# Altium schematic sheet Lin-reg.SchDoc
size A4
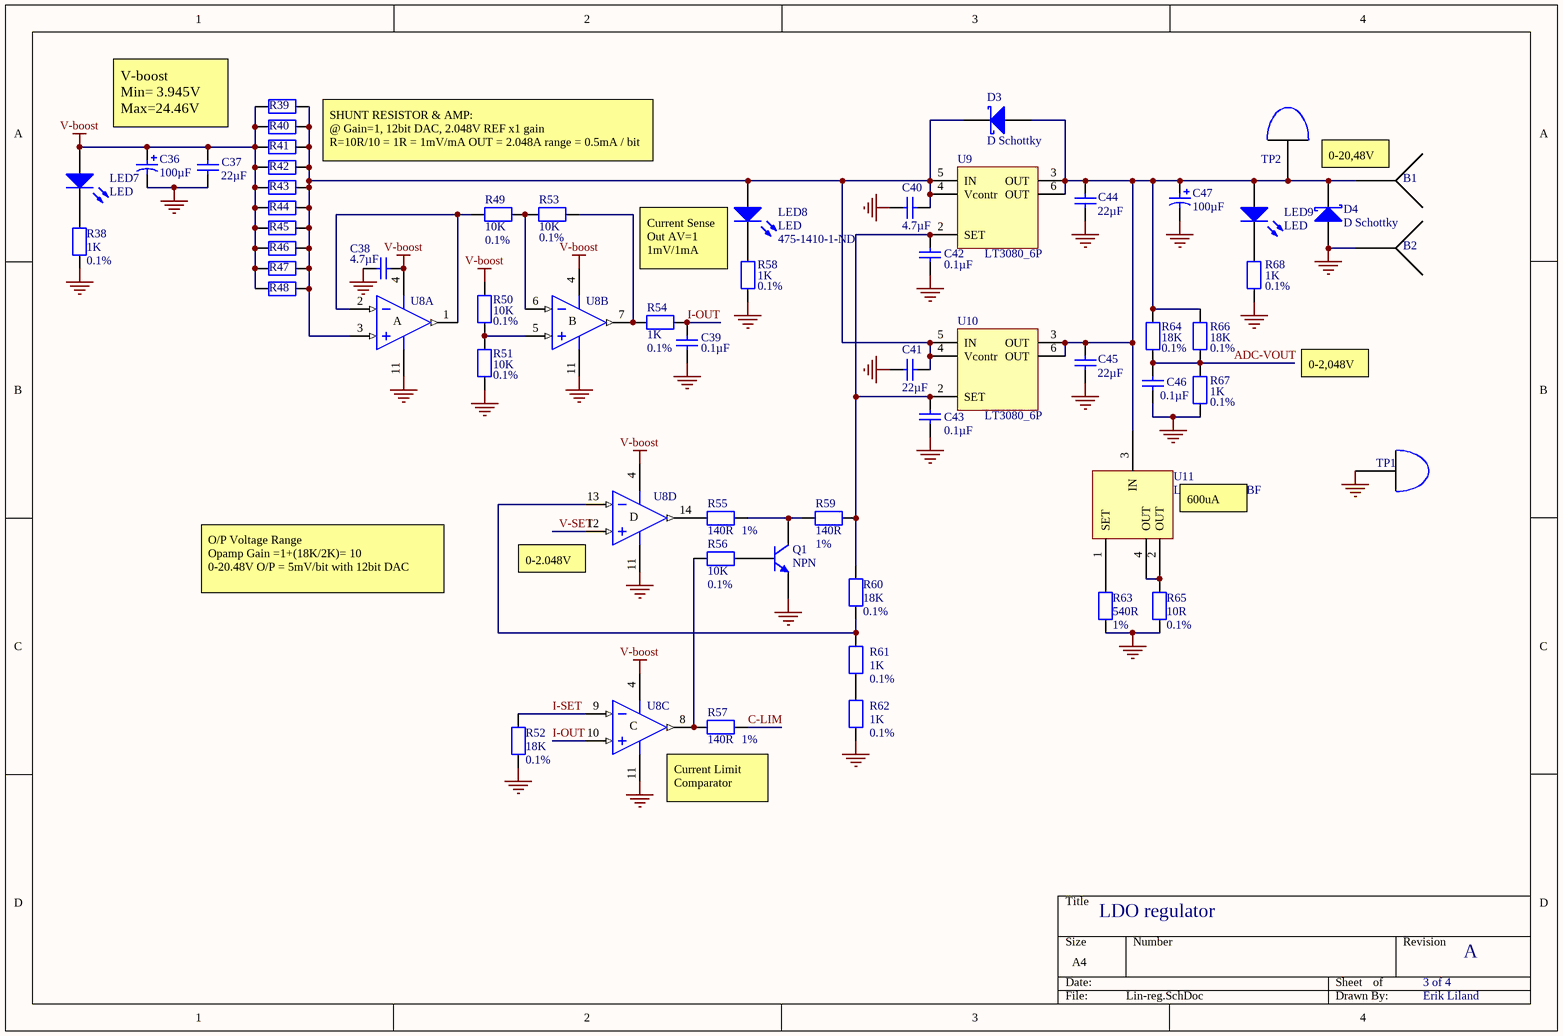
[diagram p0: Lin-reg.SchDoc]

## Parts
B1  Banana socket pcb  [PCB Banana jack red]  (value not drawn)
B2  Banana socket pcb  [PCB Banana jack black]  (value not drawn)
C36  100µF  [CAP SMD (F)]
C37  22µF  [0805_N_CAP]
C38  4.7µF  [0805_N_CAP]
C39  0.1µF  [0805_N_CAP]
C40  4.7µF  [0805_N_CAP]
C41  22µF  [0805_N_CAP]
C42  0.1µF  [0805_N_CAP]
C43  0.1µF  [0805_N_CAP]
C44  22µF  [0805_N_CAP]
C45  22µF  [0805_N_CAP]
C46  0.1µF  [0805_N_CAP]
C47  100µF  [CAP SMD (F)]
D3  D Schottky  [DO-214AC, SMA]
D4  D Schottky  [DO-214AC, SMA]
LED7  LED  [0805_N_LED]
LED8  LED  Supplier Part Number 1: 475-1410-1-ND  [0805_N_LED]
LED9  LED  [0805_N_LED]
Q1  NPN  [SOT-23_N]
R38  1K  Tolerance: 0.1%  [0805_N_RES]
R39  10R  [0805_N_RES]  (value not drawn)
R40  10R  [0805_N_RES]  (value not drawn)
R41  10R  [0805_N_RES]  (value not drawn)
R42  10R  [0805_N_RES]  (value not drawn)
R43  10R  [0805_N_RES]  (value not drawn)
R44  10R  [0805_N_RES]  (value not drawn)
R45  10R  [0805_N_RES]  (value not drawn)
R46  10R  [0805_N_RES]  (value not drawn)
R47  10R  [0805_N_RES]  (value not drawn)
R48  10R  [0805_N_RES]  (value not drawn)
R49  10K  Tolerance: 0.1%  [0805_N_RES]
R50  10K  Tolerance: 0.1%  [0805_N_RES]
R51  10K  Tolerance: 0.1%  [0805_N_RES]
R52  18K  Tolerance: 0.1%  [0805_N_RES]
R53  10K  Tolerance: 0.1%  [0805_N_RES]
R54  1K  Tolerance: 0.1%  [0805_N_RES]
R55  140R  Tolerance: 1%  [0805_N_RES]
R56  10K  Tolerance: 0.1%  [0805_N_RES]
R57  140R  Tolerance: 1%  [0805_N_RES]
R58  1K  Tolerance: 0.1%  [0805_N_RES]
R59  140R  Tolerance: 1%  [0805_N_RES]
R60  18K  Tolerance: 0.1%  [0805_N_RES]
R61  1K  Tolerance: 0.1%  [0805_N_RES]
R62  1K  Tolerance: 0.1%  [0805_N_RES]
R63  540R  Tolerance: 1%  [0805_N_RES]
R64  18K  Tolerance: 0.1%  [0805_N_RES]
R65  10R  Tolerance: 0.1%  [0805_N_RES]
R66  18K  Tolerance: 0.1%  [0805_N_RES]
R67  1K  Tolerance: 0.1%  [0805_N_RES]
R68  1K  Tolerance: 0.1%  [0805_N_RES]
TP1  Test-point  [Test point]  (value not drawn)
TP2  Test-point  [Test point]  (value not drawn)
U8  BA2902FV  [TSSOP14_N]  (value not drawn)  (parts A,B,C,D of 4)
U9  LT3080_6P  [DD-PAK-5_N_HEATSINK]
U10  LT3080_6P  [DD-PAK-5_N_HEATSINK]
U11  LT3092EST#PBF  [SOT223_N]

## Nets
GND: B2.1 C36.2 C37.2 C38.1 C39.1 C40.2 C41.2 C42.1 C43.1 C44.2 C45.2 C46.1 C47.2 D4.1(A) Q1.2(E) R38.1 R51.1 R52.1 R58.2 R62.2 R63.1 R65.2 R67.2 R68.2 TP1.1(TP) U8.11(VEE)
V-boost: C36.1 C37.1 C38.2 LED7.1(A) R39.2 R40.2 R41.2 R42.2 R43.2 R44.2 R45.2 R46.2 R47.2 R48.2 R50.2 U8.4(VCC)
ADC-VOUT: C46.2 R64.2 R66.2 R67.1
C-LIM: R57.2
I-OUT: C39.2 R54.1 U8.10(+IN3)
I-SET: R52.2 U8.9(-IN3)
V-SET: U8.12(+IN4)
NetB1_1: B1.1 C44.1 C45.1 C47.1 D3.1(A) D4.2(K) LED9.1(A) R64.1 R66.1 TP2.1(TP) U9.3(OUT) U9.6(OUT) U10.3(OUT) U10.6(OUT) U11.3(IN)
NetC40_1: C40.1 C41.1 D3.2(K) LED8.1(A) R39.1 R40.1 R41.1 R42.1 R43.1 R44.1 R45.1 R46.1 R47.1 R48.1 U8.3(+IN1) U9.4(Vcontr) U9.5(IN) U10.4(Vcontr) U10.5(IN)
NetC42_2: C42.2 C43.2 R59.2 R60.1 U9.2(SET) U10.2(SET)
NetLED7_2: LED7.2(K) R38.2
NetLED8_2: LED8.2(K) R58.1
NetLED9_2: LED9.2(K) R68.1
NetQ1_1: Q1.1(B) R56.1
NetQ1_3: Q1.3(C) R55.2 R59.1
NetR49_1: R49.1 U8.1(OUT1) U8.2(-IN1)
NetR49_2: R49.2 R53.1 U8.6(-IN2)
NetR50_1: R50.1 R51.2 U8.5(+IN2)
NetR53_2: R53.2 R54.2 U8.7(OUT2)
NetR55_1: R55.1 U8.14(OUT4)
NetR56_2: R56.2 R57.1 U8.8(OUT3)
NetR60_2: R60.2 R61.1 U8.13(-IN4)
NetR61_2: R61.2 R62.1
NetR63_2: R63.2 U11.1(SET)
NetR65_1: R65.1 U11.2(OUT) U11.4(OUT)

## Notes on the sheet
- V-boost
  Min= 3.945V
  Max=24.46V
- SHUNT RESISTOR & AMP:
  @ Gain=1, 12bit DAC, 2.048V REF x1 gain
  R=10R/10 = 1R = 1mV/mA OUT = 2.048A range = 0.5mA / bit
- (near B1) 0-20,48V
- Current Sense Out AV=1
  1mV/1mA
- 0-2,048V
- (near U11) 600uA
- (near U8) 0-2.048V
- O/P Voltage Range
  Opamp Gain =1+(18K/2K)= 10
  0-20.48V O/P = 5mV/bit with 12bit DAC
- (near U8) Current Limit Comparator
- LDO regulator
- 3 of 4
- A
- Erik Liland
- (in symbol BA2902FV, part A) A
- (in symbol BA2902FV, part B) B
- (in symbol BA2902FV, part C) C
- (in symbol BA2902FV, part D) D

## Library data of the parts
B1 B2 = Banana socket pcb: 2.54mm skrew terminal; Supplier 1: Farnell
  B1: Supplier Part Number 1: 1854508
  B2: Supplier Part Number 1: 1854507
C36 C47 = Cap Pol: Polarized Capacitor; Manufacturer: Panasonic Electronic Components; Manufacturer Part Number: EEH-ZA1H101P; Tolerance: ±20%; ESR (Equivalent Series Resistance): 28 mOhm; Lifetime @ Temp.: 10000 Hrs @ 105°C; Type: Polymer - Hybrid; Ripple Current: 2A; Surface Mount Land Size: 0.406" L x 0.406" W (10.30mm x 10.30mm); Voltage - Rated: 50V; Supplier 1: Digi-Key; Supplier Part Number 1: P15442CT-ND; RoHS: RoHS Compliant; Category: Capacitors; Stock 1: 4202; Pricing 1: 1=2.9, 10=2.406, 25=2.2996, 50=2.229, 100=2.1227, 250=1.98124 (EUR); Packaging: Cut Tape (CT); Capacitance: 100µF; Operating Temperature: -55°C ~ 105°C; Size / Dimension: 0.394" Dia (10.00mm); Height - Seated (Max): 0.413" (10.50mm); Mounting Type: Surface Mount; Package / Case: Radial, Can - SMD; ComponentLink1URL: http://industrial.panasonic.com/www-data/pdf/ABA0000/ABA0000CE136.pdf; ComponentLink1Description: http://industrial.panasonic.com/www-data/pdf/ABA0000/ABA0000CE136.pdf
C37 C41 C44 C45 = Cap: Capacitor; Manufacturer: TDK Corporation; Manufacturer Part Number: C2012X5R1V226M125AC; Tolerance: ±20%; Voltage - Rated: 35V; Temperature Coefficient: X5R; Supplier 1: Digi-Key; Supplier Part Number 1: 445-14428-1-ND; RoHS: RoHS Compliant; Category: Capacitors; Stock 1: 68492; Pricing 1: 1=1.19, 10=0.996, 100=0.6357, 250=0.52976, 500=0.47676, 1000=0.42586 (EUR); Packaging: Cut Tape (CT); Capacitance: 22µF; Mounting Type: Surface Mount, MLCC; Operating Temperature: -55°C ~ 85°C; Package / Case: 0805 (2012 Metric); Size / Dimension: 0.079" L x 0.049" W (2.00mm x 1.25mm); Height - Seated (Max): -; Thickness (Max): 0.057" (1.45mm); ComponentLink1URL: http://product.tdk.com/en/catalog/datasheets/mlcc_commercial_general_en.pdf; ComponentLink1Description: http://product.tdk.com/en/catalog/datasheets/mlcc_commercial_general_en.pdf
C38 C40 = Cap: Capacitor; Manufacturer: Samsung Electro-Mechanics America, Inc; Manufacturer Part Number: CL21B475KOFNFNE; Tolerance: ±10%; Voltage - Rated: 16V; Temperature Coefficient: X7R; Supplier 1: Digi-Key; Supplier Part Number 1: 1276-2970-1-ND; RoHS: RoHS Compliant; Category: Capacitors; Stock 1: 58798; Pricing 1: 1=0.27, 10=0.18, 25=0.1308, 100=0.0915, 500=0.06538, 1000=0.05557 (EUR); Packaging: Cut Tape (CT); Capacitance: 4.7µF; Mounting Type: Surface Mount, MLCC; Operating Temperature: -55°C ~ 125°C; Package / Case: 0805 (2012 Metric); Size / Dimension: 0.079" L x 0.049" W (2.00mm x 1.25mm); Height - Seated (Max): -; Thickness (Max): 0.053" (1.35mm); ComponentLink1URL: http://www.samsungsem.com/kr/front/downloadcms.do?path=/kr/support/product-search/mlcc/__icsFiles/afieldfile/2014/11/05&fileName=S_CL21B475KOFNFNE.pdf; ComponentLink1Description: http://www.samsungsem.com/kr/front/downloadcms.do?path=/kr/support/product-search/mlcc/__icsFiles/afieldfile/2014/11/05&fileName=S_CL21B475KOFNFNE.pdf
C39 C42 C43 C46 = Cap: Capacitor; Manufacturer: Kemet; Manufacturer Part Number: C0805C104K4RACTU; Temperature Coefficient: X7R; Tolerance: ±10%; Voltage - Rated: 16V; Capacitance: 0.1µF; Category: Capacitors; ComponentLink1Description: http://www.kemet.com/docfinder?Partnumber=C0805C104K4RACTU; ComponentLink1URL: http://www.kemet.com/docfinder?Partnumber=C0805C104K4RACTU; Height - Seated (Max): -; Mounting Type: Surface Mount, MLCC; Operating Temperature: -55°C ~ 125°C; Package / Case: 0805 (2012 Metric); Packaging: Cut Tape (CT); Pricing 1: 1=0.11, 10=0.076, 50=0.0436, 100=0.0359, 250=0.03024, 500=0.02534, 1000=0.02081 (EUR); RoHS: RoHS Compliant; Size / Dimension: 0.079" L x 0.049" W (2.00mm x 1.25mm); Stock 1: 286232; Supplier 1: Digi-Key; Supplier Part Number 1: 399-1167-1-ND; Thickness (Max): 0.035" (0.88mm)
D3 D4 = D Schottky: Schottky Diode; Manufacturer: Micro Commercial Co; Manufacturer Part Number: SK33A-TP; Voltage - DC Reverse (Vr) (Max): 30V; Current - Average Rectified (Io): 3A; Voltage - Forward (Vf) (Max) @ If: 500mV @ 3A; Speed: Fast Recovery =< 500ns, > 200mA (Io); Current - Reverse Leakage @ Vr: 500µA @ 30V; Capacitance @ Vr, F: 250pF @ 4V, 1MHz; Supplier 1: Digi-Key; Supplier Part Number 1: SK33A-TPCT-ND; RoHS: RoHS Compliant; Category: Discrete Semiconductor Products; Stock 1: 4384; Pricing 1: 1=0.57, 10=0.403, 25=0.3316, 100=0.2649, 250=0.19304, 500=0.15676, 1000=0.1205 (EUR); Packaging: Cut Tape (CT); Diode Type: Schottky; Reverse Recovery Time (trr): -; Mounting Type: Surface Mount; Package / Case: DO-214AC, SMA; Supplier Device Package: DO-214AC (HSMA); Operating Temperature - Junction: -50°C ~ 125°C; ComponentLink1URL: http://www.mccsemi.com/up_pdf/SK32A-SK310A(HSMA).PDF; ComponentLink1Description: http://www.mccsemi.com/up_pdf/SK32A-SK310A(HSMA).PDF; Published: 8-Jun-2000; LatestRevisionDate: 17-Jul-2002; LatestRevisionNote: Re-released for DXP Platform.; PackageReference: SMB; Publisher: Altium Limited; PackageDescription: DO-214-AA/SMB; 2 C-Bend Leads; Body 5.3 x 3.6 mm, inc. leads (LxW); Code_JEDEC: DO-214-AA
LED7-LED9 = LED: Typical RED, GREEN, YELLOW, AMBER; Manufacturer: OSRAM Opto Semiconductors Inc; Manufacturer Part Number: LG R971-KN-1; Wavelength - Dominant: 570nm; Wavelength - Peak: 572nm; Millicandela Rating: 26.05mcd; Voltage - Forward (Vf) (Typ): 2.2V; Current - Test: 20mA; Viewing Angle: 160°; Lens Style/Size: Rectangle with Flat Top, 1.30mm x 1.25mm; Lens Transparency: Diffused; Lens Color: White; Supplier 1: Digi-Key; RoHS: RoHS Compliant; Category: Optoelectronics; Stock 1: 152991; Pricing 1: 1=0.1, 10=0.087, 100=0.0691, 250=0.06048, 500=0.05526 (EUR); Packaging: Cut Tape (CT); Color: Green; Package / Case: 0805 (2012 Metric); Size / Dimension: 2.00mm L x 1.25mm W; Mounting Type: Surface Mount; ComponentLink1URL: http://www.osram-os.com/Graphics/XPic9/00078860_0.pdf; ComponentLink1Description: http://www.osram-os.com/Graphics/XPic9/00078860_0.pdf; Supplier Device Package: *; Height (Max): 0.90mm
  LED7 LED9: Supplier Part Number 1: 475-1410-1-ND
Q1 = NPN Transistor: NPN General Purpose Amplifier; Manufacturer: Micro Commercial Co; Manufacturer Part Number: MMBT3904-TP; Current - Collector (Ic) (Max): 200mA; Voltage - Collector Emitter Breakdown (Max): 40V; Vce Saturation (Max) @ Ib, Ic: 300mV @ 5mA, 50mA; DC Current Gain (hFE) (Min) @ Ic, Vce: 100 @ 10mA, 1V; Power - Max: 350mW; Frequency - Transition: 300MHz; Supplier 1: Digi-Key; Supplier Part Number 1: MMBT3904TPMSCT-ND; RoHS: RoHS Compliant; Category: Discrete Semiconductor Products; Stock 1: 108373; Pricing 1: 1=0.14, 10=0.128, 25=0.1168, 100=0.0841, 250=0.04956, 500=0.04112, 1000=0.02805 (EUR); Packaging: Cut Tape (CT); Transistor Type: NPN; Current - Collector Cutoff (Max): -; Mounting Type: Surface Mount; Package / Case: TO-236-3, SC-59, SOT-23-3; Supplier Device Package: SOT-23; ComponentLink1URL: http://www.mccsemi.com/up_pdf/MMBT3904(SOT-23).pdf; ComponentLink1Description: http://www.mccsemi.com/up_pdf/MMBT3904(SOT-23).pdf
R38 R54 R58 R61 R62 R67 R68 = Res: Resistor; Manufacturer: Panasonic Electronic Components; Manufacturer Part Number: ERA-6AEB102V; Power (Watts): 0.125W, 1/8W; Temperature Coefficient: ±25ppm/°C; Value: 1K; Category: Resistors; ComponentLink1Description: http://industrial.panasonic.com/www-cgi/jvcr13pz.cgi?E+PZ+3+AOA0026+ERA6AEB102V+7+WW; ComponentLink1URL: http://industrial.panasonic.com/www-cgi/jvcr13pz.cgi?E+PZ+3+AOA0026+ERA6AEB102V+7+WW; Composition: Thin Film; Height: 0.024" (0.60mm); Number of Terminations: 2; Operating Temperature: -55°C ~ 155°C; Package / Case: 0805 (2012 Metric); Packaging: Cut Tape (CT); Pricing 1: 1=0.64, 50=0.2516, 100=0.194, 250=0.15092, 500=0.10636, 1000=0.07761 (EUR); Resistance (Ohms): 1k; RoHS: RoHS Compliant; Size / Dimension: 0.079" L x 0.049" W (2.00mm x 1.25mm); Stock 1: 142110; Supplier 1: Digi-Key; Supplier Device Package: 0805; Supplier Part Number 1: P1.0KDACT-ND
R39 = Res: Resistor; Manufacturer: TE Connectivity AMP Connectors; Manufacturer Part Number: 2-1625868-7; Tolerance: 0.1%; Resistance (Ohms): 10; Power (Watts): 0.25W, 1/4W; Temperature Coefficient: ±25ppm/°C; Value: 10R; Category: Resistors; Supplier 1: Digi-Key; Supplier Part Number 1: A110351CT-ND; RoHS: RoHS Compliant; Stock 1: 1716; Pricing 1: 1=0.24, 10=0.222, 100=0.1967 (EUR); Packaging: Cut Tape (CT); Composition: Thin Film; Operating Temperature: -55°C ~ 155°C; Package / Case: 0805 (2012 Metric); Supplier Device Package: 0805; Size / Dimension: 0.079" L x 0.049" W (2.00mm x 1.25mm); Height: 0.026" (0.65mm); Number of Terminations: 2; ComponentLink1URL: http://www.te.com/commerce/DocumentDelivery/DDEController?Action=srchrtrv&DocNm=1773272&DocType=DS&DocLang=English; ComponentLink1Description: http://www.te.com/commerce/DocumentDelivery/DDEController?Action=srchrtrv&DocNm=1773272&DocType=DS&DocLang=English
R40-R48 = Res: Resistor; Manufacturer: TE Connectivity AMP Connectors; Manufacturer Part Number: 2-1625868-7; Tolerance: 0.1%; Power (Watts): 0.25W, 1/4W; Resistance (Ohms): 10; Temperature Coefficient: ±25ppm/°C; Value: 10R; Category: Resistors; ComponentLink1Description: http://www.te.com/commerce/DocumentDelivery/DDEController?Action=srchrtrv&DocNm=1773272&DocType=DS&DocLang=English; ComponentLink1URL: http://www.te.com/commerce/DocumentDelivery/DDEController?Action=srchrtrv&DocNm=1773272&DocType=DS&DocLang=English; Composition: Thin Film; Height: 0.026" (0.65mm); Number of Terminations: 2; Operating Temperature: -55°C ~ 155°C; Package / Case: 0805 (2012 Metric); Packaging: Cut Tape (CT); Pricing 1: 1=0.24, 10=0.222, 100=0.1967 (EUR); RoHS: RoHS Compliant; Size / Dimension: 0.079" L x 0.049" W (2.00mm x 1.25mm); Stock 1: 1716; Supplier 1: Digi-Key; Supplier Device Package: 0805; Supplier Part Number 1: A110351CT-ND
R49-R51 R53 R56 = Res: Resistor; Manufacturer: TE Connectivity AMP Connectors; Manufacturer Part Number: 8-1614884-4; Power (Watts): 0.1W, 1/10W; Temperature Coefficient: ±25ppm/°C; Value: 10K; Category: Resistors; Supplier 1: Digi-Key; Supplier Part Number 1: A103142CT-ND; RoHS: RoHS Compliant; Stock 1: 18690; Pricing 1: 1=0.18, 100=0.1714, 500=0.16136 (EUR); Packaging: Cut Tape (CT); Resistance (Ohms): 10k; Composition: Thin Film; Operating Temperature: -55°C ~ 155°C; Package / Case: 0805 (2012 Metric); Supplier Device Package: 0805; Size / Dimension: 0.079" L x 0.049" W (2.00mm x 1.25mm); Height: 0.026" (0.65mm); Number of Terminations: 2; ComponentLink1URL: http://www.te.com/commerce/DocumentDelivery/DDEController?Action=srchrtrv&DocNm=1773200&DocType=DS&DocLang=English; ComponentLink1Description: http://www.te.com/commerce/DocumentDelivery/DDEController?Action=srchrtrv&DocNm=1773200&DocType=DS&DocLang=English
R52 R60 R64 R66 = Res: Resistor; Manufacturer: Panasonic Electronic Components; Manufacturer Part Number: ERA-6AEB183V; Power (Watts): 0.125W, 1/8W; Temperature Coefficient: ±25ppm/°C; Value: 18K; Category: Resistors; Supplier 1: Digi-Key; Supplier Part Number 1: P18KDACT-ND; RoHS: RoHS Compliant; Stock 1: 21371; Pricing 1: 1=0.64, 50=0.2516, 100=0.194, 250=0.15092, 500=0.10636, 1000=0.07761 (EUR); Packaging: Cut Tape (CT); Resistance (Ohms): 18k; Composition: Thin Film; Operating Temperature: -55°C ~ 155°C; Package / Case: 0805 (2012 Metric); Supplier Device Package: 0805; Size / Dimension: 0.079" L x 0.049" W (2.00mm x 1.25mm); Height: 0.024" (0.60mm); Number of Terminations: 2; ComponentLink1URL: http://industrial.panasonic.com/www-cgi/jvcr13pz.cgi?E+PZ+3+AOA0026+ERA6AEB183V+7+WW; ComponentLink1Description: http://industrial.panasonic.com/www-cgi/jvcr13pz.cgi?E+PZ+3+AOA0026+ERA6AEB183V+7+WW
R55 R57 R59 = Res: Resistor; Manufacturer: Samsung Electro-Mechanics America, Inc; Manufacturer Part Number: RC2012F1400CS; Power (Watts): 0.125W, 1/8W; Resistance (Ohms): 140; Temperature Coefficient: ±100ppm/°C; Value: 140R; Category: Resistors; ComponentLink1Description: http://www.samsungsem.com/global/support/library/product-catalog/__icsFiles/afieldfile/2015/01/12/CHIP_RESISTOR_150112_1.pdf; ComponentLink1URL: http://www.samsungsem.com/global/support/library/product-catalog/__icsFiles/afieldfile/2015/01/12/CHIP_RESISTOR_150112_1.pdf; Composition: Thick Film; Height: 0.024" (0.60mm); Number of Terminations: 2; Operating Temperature: -55°C ~ 155°C; Package / Case: 0805 (2012 Metric); Packaging: Cut Tape (CT); Pricing 1: 1=0.1, 10=0.022, 25=0.016, 100=0.0092, 500=0.00558, 1000=0.00411, 2500=0.00358 (EUR); RoHS: RoHS Compliant; Size / Dimension: 0.079" L x 0.049" W (2.00mm x 1.25mm); Stock 1: 7060; Supplier 1: Digi-Key; Supplier Device Package: 0805 (2012 Metric); Supplier Part Number 1: 1276-5229-1-ND
R63 = Res: Resistor; Value: 540R; Category: Resistors
R65 = Res: Resistor; Manufacturer: TE Connectivity AMP Connectors; Manufacturer Part Number: 2-1625868-7; Power (Watts): 0.25W, 1/4W; Resistance (Ohms): 10; Temperature Coefficient: ±25ppm/°C; Value: 10R; Category: Resistors; ComponentLink1Description: http://www.te.com/commerce/DocumentDelivery/DDEController?Action=srchrtrv&DocNm=1773272&DocType=DS&DocLang=English; ComponentLink1URL: http://www.te.com/commerce/DocumentDelivery/DDEController?Action=srchrtrv&DocNm=1773272&DocType=DS&DocLang=English; Composition: Thin Film; Height: 0.026" (0.65mm); Number of Terminations: 2; Operating Temperature: -55°C ~ 155°C; Package / Case: 0805 (2012 Metric); Packaging: Cut Tape (CT); Pricing 1: 1=0.24, 10=0.222, 100=0.1967 (EUR); RoHS: RoHS Compliant; Size / Dimension: 0.079" L x 0.049" W (2.00mm x 1.25mm); Stock 1: 1716; Supplier 1: Digi-Key; Supplier Device Package: 0805; Supplier Part Number 1: A110351CT-ND
TP1 TP2 = Test point
U8 = BA2902FV: Quad Low-Power Operational Amplifier; Manufacturer: Rohm Semiconductor; Manufacturer Part Number: BA2902FV-E2; Amplifier Type: General Purpose; Number of Circuits: 4; Slew Rate: 0.2 V/µs; Gain Bandwidth Product: 500kHz; Current - Input Bias: 20nA; Voltage - Input Offset: 2mV; Current - Supply: 700µA; Current - Output / Channel: 30mA; Voltage - Supply, Single/Dual (±): 3 V ~ 32 V, ±1.5 V ~ 16 V; Supplier 1: Digi-Key; RoHS: RoHS Compliant; Category: Integrated Circuits (ICs); Stock 1: 9768; Pricing 1: 1=0.87, 10=0.76, 25=0.6724, 100=0.586, 250=0.51012, 500=0.4342, 1000=0.34779 (EUR); Packaging: Cut Tape (CT); Output Type: -; -3db Bandwidth: -; Operating Temperature: -40°C ~ 125°C; Mounting Type: Surface Mount; Package / Case: 14-LSSOP (0.173", 4.40mm Width); Supplier Device Package: 14-SSOP; ComponentLink1URL: http://rohmfs.rohm.com/en/products/databook/datasheet/ic/amp_linear/opamp/ba10358f-e.pdf; ComponentLink1Description: http://rohmfs.rohm.com/en/products/databook/datasheet/ic/amp_linear/opamp/ba10358f-e.pdf; Supplier Part Number 1: BA2902FV-E2CT-ND
U9 U10 = LT3080_6P: LT3080 LDO regulator; Manufacturer: Linear Technology; Manufacturer Part Number: LT3080EQ#PBF; Regulator Topology: Positive Adjustable; Voltage - Output: 0 V ~ 36 V; Current - Output: 1.1A; Voltage - Dropout (Typical): 1.35V @ 1.1A; Number of Regulators: 1; Voltage - Input: 1.2 V ~ 36 V; Supplier 1: Digi-Key; Supplier Part Number 1: LT3080EQ#PBF-ND; RoHS: RoHS Compliant; Category: Integrated Circuits (ICs); Stock 1: 1598; Pricing 1: 1=4.68, 25=3.3412, 100=2.8409 (EUR); Packaging: Tube; Current - Limit (Min): 1.1A; Operating Temperature: -40°C ~ 125°C; Mounting Type: Surface Mount; Package / Case: TO-263-6, D²Pak (5 Leads + Tab), TO-263BA; Supplier Device Package: 5-DDPAK; ComponentLink1URL: http://www.linear.com/docs/25276; ComponentLink1Description: http://www.linear.com/docs/25276
U11 = LT3092: Current source; Manufacturer: Linear Technology; Accuracy: ±1%; Voltage - Input: 1.2 V ~ 40 V; Current - Output: 200mA; RoHS: RoHS Compliant; ComponentLink1Description: http://www.linear.com/docs/27892; ComponentLink1URL: http://www.linear.com/docs/27892; Supplier 1: Digi-Key; Supplier Part Number 1: LT3092EST#PBF-ND; Manufacturer Part Number: LT3092EST#PBF; Category: Integrated Circuits (ICs); Stock 1: 3473; Pricing 1: 1=3.98, 25=2.66, 100=2.2664 (EUR); Packaging: Tube; Function: Current Source; Sensing Method: -; Operating Temperature: -40°C ~ 125°C; Mounting Type: Surface Mount; Package / Case: TO-261-4, TO-261AA; Supplier Device Package: SOT-223